# EAGLE design cheenrimen (EAGLE 7.6.0)
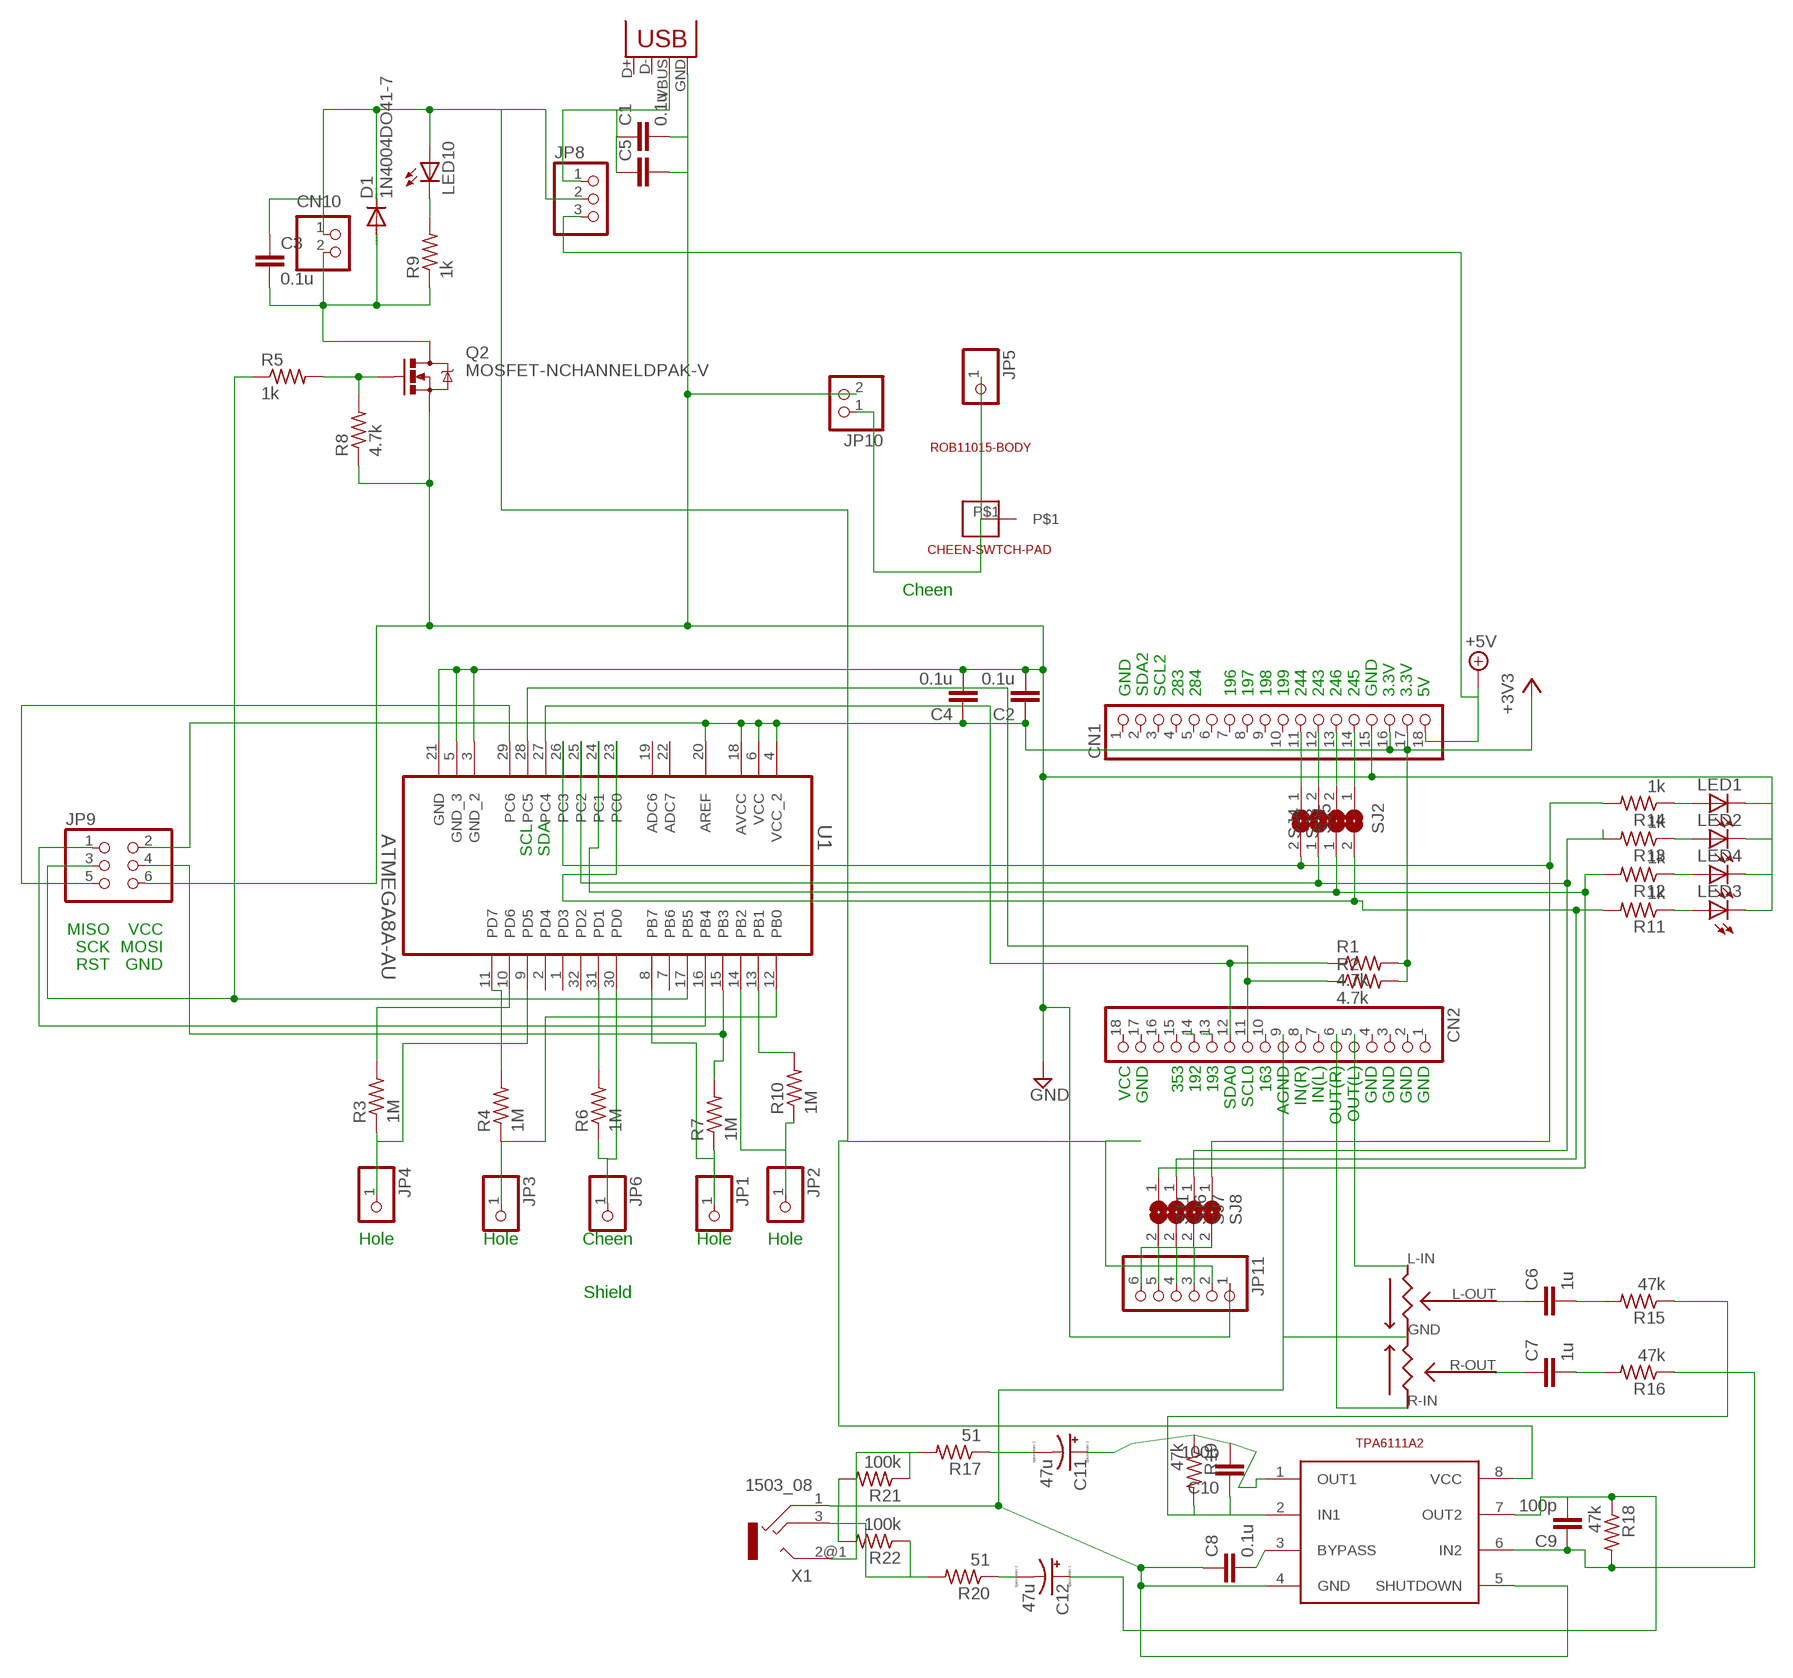
[diagram p0: schematic, sheet 1]

## Parts
C1  0.1u  C-EUC0603K  [C0603K]
C2  0.1u  C-EUC0603K  [C0603K]
C3  0.1u  C-EUC0603K  [C0603K]
C4  0.1u  C-EUC0603K  [C0603K]
C5  C-EUC0805  [C0805]
C6  1u  C-EUC0603K  [C0603K]
C7  1u  C-EUC0603K  [C0603K]
C8  0.1u  C-EUC0603K  [C0603K]
C9  100p  C-EUC0603K  [C0603K]
C10  100p  C-EUC0603K  [C0603K]
C11  47u  CPOL-US153CLV-0605  [153CLV-0605]
C12  47u  CPOL-US153CLV-0605  [153CLV-0605]
CN1  PINHD-1X18  [1X18]
CN2  PINHD-1X18  [1X18]
CN10  B2B-PH-K-S  [B2B-PH-K-S]
D1  1N4004DO41-7  [DO41-7.6]
JP1  PINHD-1X15MM  [1X01-LARGE]
JP2  PINHD-1X15MM  [1X01-LARGE]
JP3  PINHD-1X15MM  [1X01-LARGE]
JP4  PINHD-1X15MM  [1X01-LARGE]
JP5  PINHD-1X1NORMAL  [1X01-S]
JP6  PINHD-1X1NORMAL  [1X01-S]
JP7  USB-MICROB  [USB-MICROB]
JP8  PINHD-1X3  [1X03]
JP9  PINHD-2X3  [2X03]
JP10  PINHD-1X2  [1X02]
JP11  PINHD-1X6  [1X06]
LED1  LEDSML0805  [SML0805]
LED2  LEDSML0805  [SML0805]
LED3  LEDSML0805  [SML0805]
LED4  LEDSML0805  [SML0805]
LED10  LED3MM  [LED3MM]
Q2  MOSFET-NCHANNELDPAK-V  [DPAK-V]
R1  4.7k  R-US_R0603  [R0603]
R2  4.7k  R-US_R0603  [R0603]
R3  1M  R-US_R0805  [R0805]
R4  1M  R-US_R0805  [R0805]
R5  1k  R-US_R0603  [R0603]
R6  1M  R-US_R0805  [R0805]
R7  1M  R-US_R0805  [R0805]
R8  4.7k  R-US_R0603  [R0603]
R9  1k  R-US_R0603  [R0603]
R10  1M  R-US_R0805  [R0805]
R11  1k  R-US_R0603  [R0603]
R12  1k  R-US_R0603  [R0603]
R13  1k  R-US_R0603  [R0603]
R14  1k  R-US_R0603  [R0603]
R15  47k  R-US_R0603  [R0603]
R16  47k  R-US_R0603  [R0603]
R17  51  R-US_R0603  [R0603]
R18  47k  R-US_R0603  [R0603]
R19  47k  R-US_R0603  [R0603]
R20  51  R-US_R0603  [R0603]
R21  100k  R-US_R0603  [R0603]
R22  100k  R-US_R0603  [R0603]
SJ1  SJ  [SJ]
SJ2  SJ  [SJ]
SJ3  SJ  [SJ]
SJ4  SJ  [SJ]
SJ5  SJ  [SJ]
SJ6  SJ  [SJ]
SJ7  SJ  [SJ]
SJ8  SJ  [SJ]
U1  ATMEGA8A-AU  [QFP80P900X900X120-32N]
U$2  CHEEN-SWITCH-PAD  [CHEEN-SWITCH-PAD]
U$3  ROB11015-BODY  [SOLENOID-ROB11015-BODY]
U$4  5PIN-RADIO-POT  [5PIN-RADIO-POT]
U$5  TPA6111A2  [MSOP8]
X1  1503_08  [1503_08]

## Nets
+3V3: C2.1 C4.1 CN1.16 CN1.17 JP9.2 R1.2 R2.2 U1.4(VCC_2) U1.6(VCC) U1.18(AVCC) U1.20(AREF)
+5V: CN1.18 JP8.3
+5V/1: C3.1 CN10.1 D1.C JP8.2 JP11.2 LED10.A U$5.8(VCC)
AGND: C8.1 CN2.9 R21.2 R22.2 U$4.GND U$5.4(GND) U$5.5(SHUTDOWN) X1.1(GND)
GND [GND]: C1.2 C2.2 C4.2 C5.2 CN1.15 JP7.GND JP9.6 JP10.2 JP11.1 LED1.C LED2.C LED3.C LED4.C Q2.P$3(S) R8.1 U1.3(GND_2) U1.5(GND_3) U1.21(GND)
N$1: C1.1 C5.1 JP7.VBUS JP8.1
N$2: JP9.1 U1.16(PB4)
N$3: CN1.14 SJ2.1
N$4: CN1.13 SJ3.2
N$5: CN1.12 SJ4.2
N$6: JP5.1 JP10.1 U$2.P$1
N$7: CN2.11 R2.1 U1.28(PC5)
N$8: JP9.3 R5.1 U1.17(PB5)
N$9: CN2.12 R1.1 U1.27(PC4)
N$10: R3.2 U1.10(PD6)
N$11: JP4.1 R3.1 U1.9(PD5)
N$12: CN1.11 SJ5.1
N$13: Q2.P$1(G) R5.2 R8.2
N$14: C3.2 CN10.2 D1.A Q2.P$2(D) R9.1
N$15: R6.2 U1.31(PD1)
N$16: LED10.K(C) R9.2
N$17: JP2.1 R10.1 U1.14(PB2)
N$18: R4.2 U1.11(PD7)
N$19: JP3.1 R4.1 U1.12(PB0)
N$20: R10.2 U1.13(PB1)
N$21: JP6.1 R6.1 U1.30(PD0)
N$22: JP9.4 R7.2 U1.15(PB3)
N$23: JP1.1 R7.1 U1.8(PB7)
N$24: JP9.5 U1.29(PC6)
N$25: R14.2 SJ5.2 SJ8.1 U1.26(PC3)
N$26: R13.2 SJ4.1 SJ7.1 U1.25(PC2)
N$27: R12.2 SJ1.1 SJ3.1 U1.24(PC1)
N$28: R11.2 SJ2.2 SJ6.1 U1.23(PC0)
N$29: LED1.A R14.1
N$30: LED2.A R13.1
N$31: LED4.A R12.1
N$32: LED3.A R11.1
N$33: JP11.6 SJ1.2
N$34: CN2.14
N$35: CN2.13
N$36: JP11.5 SJ6.2
N$37: JP11.4 SJ7.2
N$38: JP11.3 SJ8.2
N$39: R17.2 R21.1 X1.2@1(L)
N$40: CN2.5 U$4.L-IN(IN-L)
N$41: CN2.6 U$4.R-IN(IN-R)
N$42: C6.1 U$4.L-OUT(OUT-L)
N$43: C7.1 U$4.R-OUT(OUT-R)
N$44: C6.2 R15.2
N$45: C7.2 R16.2
N$46: C10.1 R15.1 R19.2 U$5.2(IN1)
N$47: C9.1 R16.1 R18.2 U$5.6(IN2)
N$48: C11.- R17.1
N$49: C8.2 U$5.3(BYPASS)
N$50: C9.2 C12.+ R18.1 U$5.7(OUT2)
N$51: C10.2 C11.+ R19.1 U$5.1(OUT1)
N$53: R20.2 R22.1 X1.3(R)
N$54: C12.- R20.1
Unconnected: CN1.1 CN1.2 CN1.3 CN1.4 CN1.5 CN1.6 CN1.7 CN1.8 CN1.9 CN1.10 CN2.1 CN2.2 CN2.3 CN2.4 CN2.7 CN2.8 CN2.10 CN2.15 CN2.16 CN2.17 CN2.18 JP7.D+ JP7.D- U1.1(PD3) U1.2(PD4) U1.7(PB6) U1.19(ADC6) U1.22(ADC7) U1.32(PD2) X1.2@2

## Notes on the sheet
- Cheen
- GND
  SDA2
  SCL2
  283
  284
  
  196
  197
  198
  199
  244
  243
  246
  245
  GND
  3.3V
  3.3V
  5V
- SCL | SDA
- MISO
  SCK
  RST
- VCC
  MOSI
  GND
- VCC
  GND
  
  353
  192
  193
  SDA0
  SCL0
  163
  AGND
  IN(R)
  IN(L)
  OUT(R)
  OUT(L)
  GND
  GND
  GND
  GND
- Hole | Hole | Cheen | Hole | Hole
- Shield

## Library data of the parts
C1-C4 C6-C10 = resistor:C-EU: CAPACITOR, European symbol
C5 = 0my:C-EU: CAPACITOR, European symbol
C11 C12 = 0my:CPOL-US: POLARIZED CAPACITOR, American symbol
CN1 CN2 = pinhead:PINHD-1X18: PIN HEADER
CN10 = 0-cheen:B2B-PH-*: Wire-to-Board 2.0mm pitch top mount connector Source: http://www.jst-mfg.com/product/pdf/jpn/PH.pdf http://www.jst-mfg.com/product/detail.php?series=199
D1 = 0my:1N4004: DIODE general purpose rectifier, 1 A
JP1-JP4 = 0my:PINHD-1X1: PIN HEADER
JP5 JP6 = 0-cheen:PINHD-1X1: PIN HEADER
JP7 = 0-cheen:USB: USB Connectors USB-B-PTH is fully proven SKU : PRT-00139/CONN-08278 USB-miniB is fully proven SKU : PRT-00587 USB-A-PCB is untested. USB-A-H is throughly reviewed, but untested. Spark Fun Electronics SKU : PRT-00437 USB-B-SMT is throughly reviewed, but untested. Needs silkscreen touching up. USB-A-S has not been used/tested USB-MB-H has not been used/tested USB-MICROB has been used. CONN-09505; PROD_ID: CONN-09505
JP8 = 0-cheen:PINHD-1X3: PIN HEADER
JP9 = 0my:PINHD-2X3: PIN HEADER
JP10 = 0my:PINHD-1X2: PIN HEADER
JP11 = pinhead:PINHD-1X6: PIN HEADER
LED1-LED4 LED10 = led:LED: LED OSRAM: - CHIPLED LG R971, LG N971, LY N971, LG Q971, LY Q971, LO R971, LY R971 LH N974, LH R974 LS Q976, LO Q976, LY Q976 LO Q996 - Hyper CHIPLED LW Q18S LB Q993, LB Q99A, LB R99A - SideLED LS A670, LO A670, LY A670, LG A670, LP A670 LB A673, LV A673, LT A673, LW A673 LH A674 LY A675 LS A676, LA A676, LO A676, LY A676, LW A676 LS A679, LY A679, LG A679 - Hyper Micro SIDELED® LS Y876, LA Y876, LO Y876, LY Y876 LT Y87S - SmartLED LW L88C, LW L88S LB L89C, LB L89S, LG L890 LS L89K, LO L89K, LY L89K LS L896, LA L896, LO L896, LY L896 - TOPLED LS T670, LO T670, LY T670, LG T670, LP T670 LSG T670, LSP T670, LSY T670, LOP T670, LYG T670 LG T671, LOG T671, LSG T671 LB T673, LV T673, LT T673, LW T673 LH T674 LS T676, LA T676, LO T676, LY T676, LB T676, LH T676, LSB T676, LW T676 LB T67C, LV T67C, LT T67C, LS T67K, LO T67K, LY T67K, LW E67C LS E67B, LA E67B, LO E67B, LY E67B, LB E67C, LV E67C, LT E67C LW T67C LS T679, LY T679, LG T679 LS T770, LO T770, LY T770, LG T770, LP T770 LB T773, LV T773, LT T773, LW T773 LH T774 LS E675, LA E675, LY E675, LS T675 LS T776, LA T776, LO T776, LY T776, LB T776 LHGB T686 LT T68C, LB T68C - Hyper Mini TOPLED® LB M676 - Mini TOPLED Santana® LG M470 LS M47K, LO M47K, LY M47K Source: http://www.osram.convergy.de LUXEON: - LUMILED® LXK2-PW12-R00, LXK2-PW12-S00, LXK2-PW14-U00, LXK2-PW14-V00 LXK2-PM12-R00, LXK2-PM12-S00, LXK2-PM14-U00 LXK2-PE12-Q00, LXK2-PE12-R00, LXK2-PE12-S00, LXK2-PE14-T00, LXK2-PE14-U00 LXK2-PB12-K00, LXK2-PB12-L00, LXK2-PB12-M00, LXK2-PB14-N00, LXK2-PB14-P00, LXK2-PB14-Q00 LXK2-PR12-L00, LXK2-PR12-M00, LXK2-PR14-Q00, LXK2-PR14-R00 LXK2-PD12-Q00, LXK2-PD12-R00, LXK2-PD12-S00 LXK2-PH12-R00, LXK2-PH12-S00 LXK2-PL12-P00, LXK2-PL12-Q00, LXK2-PL12-R00 Source: www.luxeon.com KINGBRIGHT: KA-3528ASYC Source: www.kingbright.com
Q2 = 0my:MOSFET-NCHANNEL: Generic NMOS footprint
R1-R22 = 0my:R-US_: RESISTOR, American symbol
SJ1-SJ8 = jumper:SJ: SMD solder JUMPER
U1 = Atmel_By_element14_Batch_1-00:ATMEGA8A-AU: Programmable Flash; MPN: ATMEGA8A-AU; OC_FARNELL: 1748532; OC_NEWARK: 26R5638; PACKAGE: TQFP-32; SUPPLIER: Atmel
U$2 = 0-cheen:CHEEN-SWITCH-PAD
U$3 = 0-cheen:ROB11015-BODY
U$4 = 0-cheen:5PIN-RADIO-POT
U$5 = 0-cheen:TPA6111A2
X1 = 0my:1503_?: Jack connectors according to JISC 6560, 3.5 mm Klinkensteckverbinder nach JISC 6560, 3,5 mm Source: http://www.lumberg.com/Produkte/PDFs/1503_08.pdf; OC_FARNELL: unknown; OC_NEWARK: unknown

## Net classes
0 default: width 0.406 mm, drill 0.305 mm, clearance 0.305 mm
2 GND: width 0.813 mm, drill 0.61 mm, clearance 0.406 mm

## Board
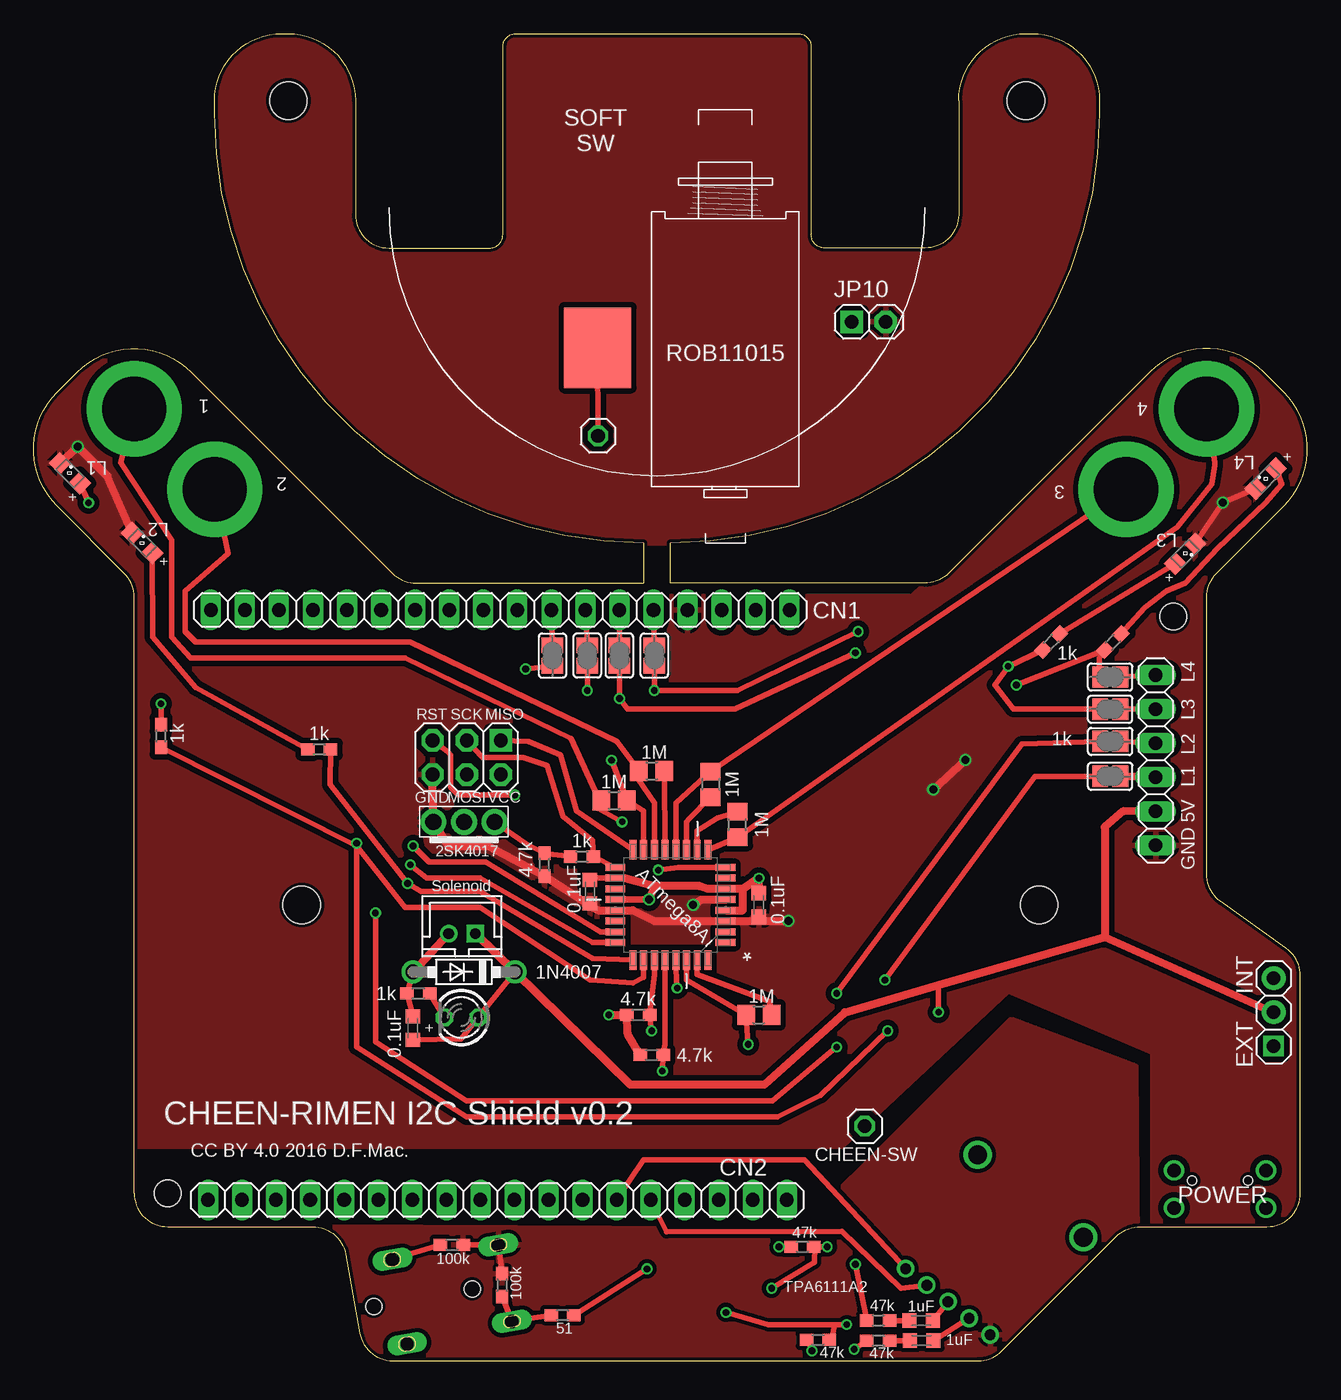
[diagram p1: board, top side]
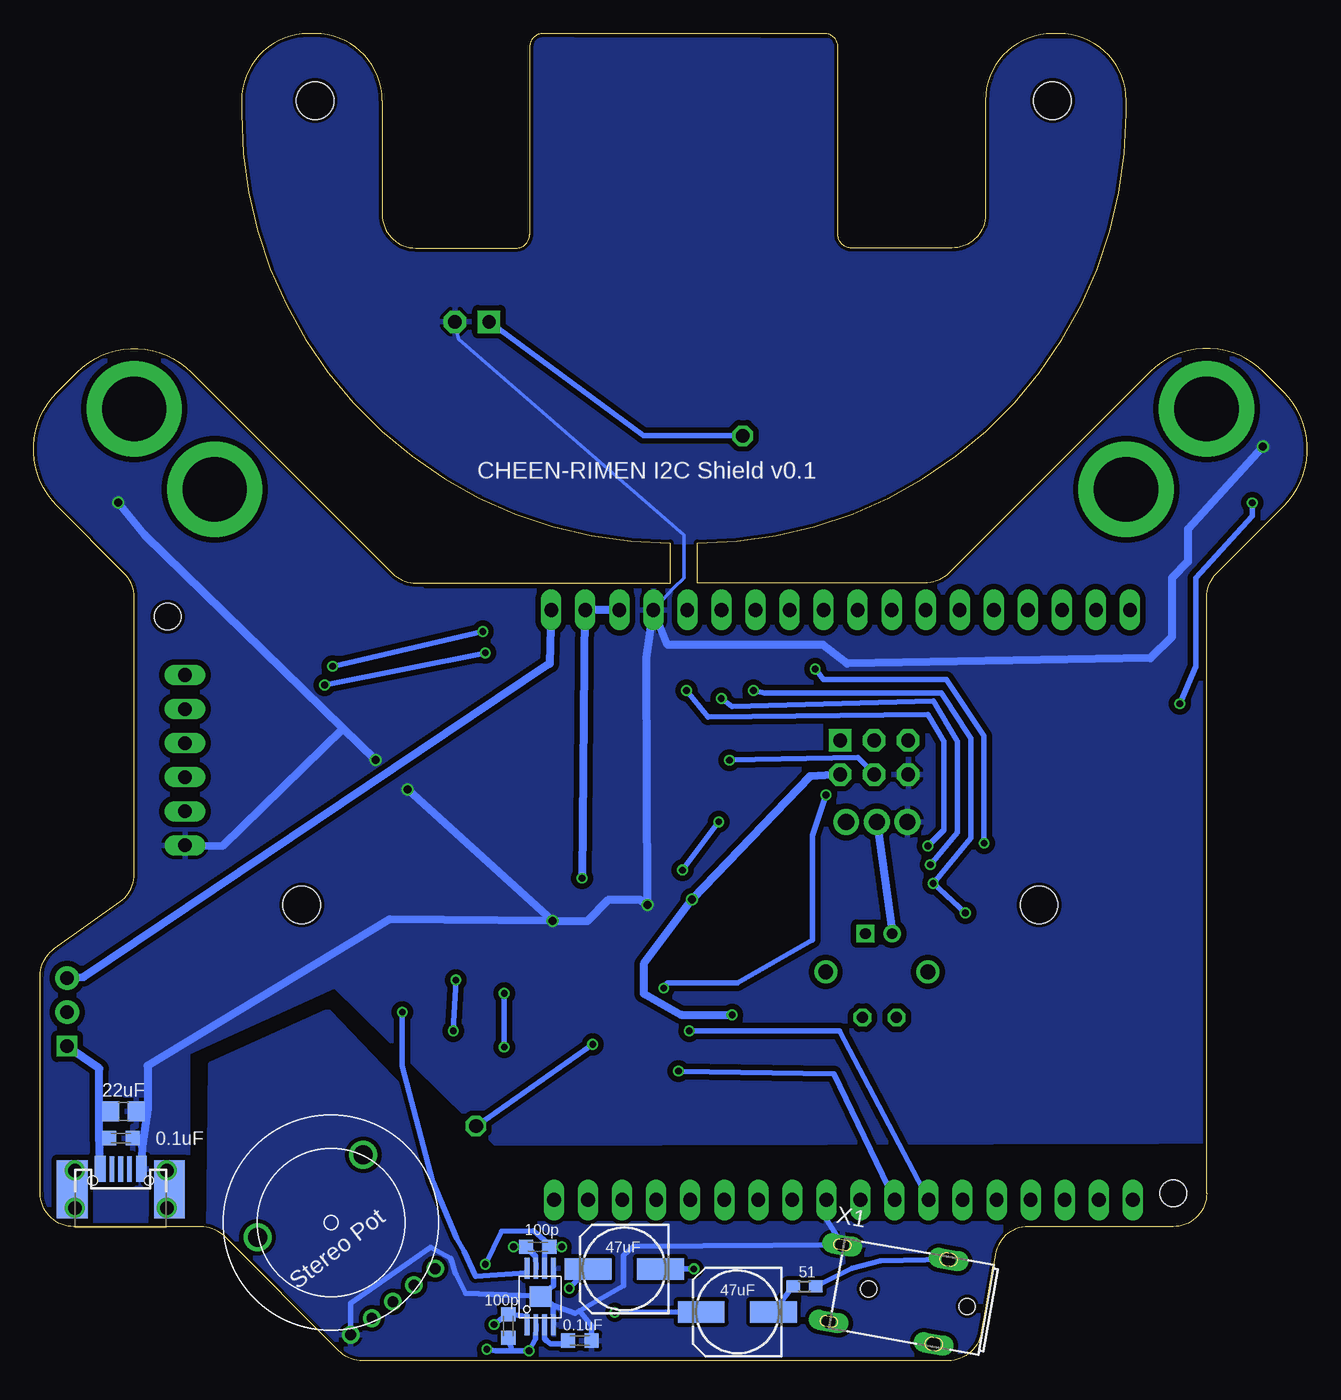
[diagram p2: board, bottom side, seen from below]

Size 95.02 x 99 mm. Coordinates in mm from the lower left corner, seen from the top.
Outline: 7.51,12.5 7.51,56.96 arc45 6.78,58.73 1.75,63.76 arc-90 1.75,72.24 3.27,73.76 arc-90 11.75,73.76 26.78,58.73 arc45 28.54,58 45.51,58 45.51,61 arc-90 13.51,93 13.51,94 arc-90 18.51,99 19.01,99 arc-90 24.01,94 24.01,85.5 arc90 26.51,83 34.01,83 arc90 35.01,84 35.01,98 arc-90 36.01,99 57.01,99 arc-90 58.01,98 58.01,84 arc90 59.01,83 66.51,83 arc90 69.01,85.5 69.01,94 arc-90 74.01,99 74.51,99 arc-90 79.51,94 79.51,93 arc-90 47.51,61 47.51,58 66.47,58 arc45 68.24,58.73 83.27,73.76 arc-90 91.75,73.76 93.27,72.24 arc-90 93.27,63.76 88.24,58.73 arc45 87.51,56.96 87.51,36.29 arc54 88.56,34.25 93.46,30.75 arc-54 94.51,28.71 94.51,12.5 arc-90 92.01,10 82.54,10 arc45 80.78,9.27 72.24,0.73 arc-45 70.47,0 26.8,0 arc-80 24.34,2.06 23.28,7.94 arc80 20.82,10 10.01,10 arc-90 7.51,12.5
Copper layers (1*16): Top 0.035mm / dielectric 1.5mm / Bottom 0.035mm
Design rules "Elecrow_2-layer_eagle_rule": minimum track width 6mil, minimum drill 12mil, track to track 6mil, track to pad 6mil, pad to pad 6mil, via to via 6mil, smd to smd 0mil, copper to edge 10mil, drill to drill 10mil, minimum pad ring 10mil, minimum via ring 6mil, stop-mask expansion 2mil, vias tented up to drill 100mil, thermal gap 10mil
Holes 2.8 mm at 20.01,34 75.01,34 19.01,94 74.01,94
Holes 2 mm at 10.01,12.5 85.01,55.5

### Footprints (pad centres in the part's own frame; a part is rotated, then mirrored left to right if it is on the bottom)
C0603K = smd 1.05 x 1.08: 1 -0.875,0; 2 0.875,0
C0805 = smd 1.3 x 1.5: 1 -0.95,0; 2 0.95,0
153CLV-0605 = smd 3.5 x 1.6: + 2.7,0; - -2.7,0
1X18 = drill 1.016 long: 1 -21.59,0; 2 -19.05,0; 3 -16.51,0; 4 -13.97,0; 5 -11.43,0; 6 -8.89,0; 7 -6.35,0; 8 -3.81,0; 9 -1.27,0; 10 1.27,0; 11 3.81,0; 12 6.35,0; 13 8.89,0; 14 11.43,0; 15 13.97,0; 16 16.51,0; 17 19.05,0; 18 21.59,0
B2B-PH-K-S = drill 0.8 square: 1 -1,0 | drill 0.8: 2 1,0
DO41-7.6 = drill 1.1 pad 1.7: A 3.81,0; C -3.81,0
1X01-LARGE = drill 4.8 pad 7.112: 1 0,0
1X01-S = drill 1.016 octagon: 1 0,0
USB-MICROB = smd 0.35 x 1.9: D+ 0,2.904; D- -0.65,2.904; ID 0.65,2.904 | smd 0.813 x 1.93: GND 1.541,2.929; VBUS -1.541,2.929 | smd 2.286 x 4.318: MT1 3.62,1.397; MT3 -3.619,1.397 | drill 1: P$2 -3.429,2.794; P$4 -3.429,0; P$5 3.429,2.794; P$6 3.429,0 | hole 0.7: -2.095,2.032; 2.095,2.032
1X03 = drill 1.016 square: 1 -2.54,0 | drill 1.016 pad 1.778: 2 0,0; 3 2.54,0
2X03 = drill 1.016 pad 1.676 square: 1 -2.54,-1.27 | drill 1.016 pad 1.676 octagon: 2 -2.54,1.27; 3 0,-1.27; 4 0,1.27; 5 2.54,-1.27; 6 2.54,1.27
1X02 = drill 1 pad 1.676 square: 1 -1.27,0 | drill 1 pad 1.676 octagon: 2 1.27,0
1X06 = drill 1.016 long: 1 -6.35,0; 2 -3.81,0; 3 -1.27,0; 4 1.27,0; 5 3.81,0; 6 6.35,0
SML0805 = smd 1.2 x 1.2: A 1.05,0; C -1.05,0
LED3MM = drill 0.813 octagon: A -1.27,0; K 1.27,0
DPAK-V = drill 1.2 pad 1.93: P$1 -2.286,0; P$2 0,0; P$3 2.286,0
R0603 = smd 1 x 0.9: 1 -0.85,0; 2 0.85,0
R0805 = smd 1.3 x 1.5: 1 -0.95,0; 2 0.95,0
SJ = smd 1.168 x 1.6: 1 -0.762,0; 2 0.762,0
QFP80P900X900X120-32N = smd 1.473 x 0.508: 1 -4.115,2.794; 2 -4.115,2.007; 3 -4.115,1.194; 4 -4.115,0.406; 5 -4.115,-0.406; 6 -4.115,-1.194; 7 -4.115,-2.007; 8 -4.115,-2.794; 17 4.115,-2.794; 18 4.115,-2.007; 19 4.115,-1.194; 20 4.115,-0.406; 21 4.115,0.406; 22 4.115,1.194; 23 4.115,2.007; 24 4.115,2.794 | smd 0.508 x 1.473: 9 -2.794,-4.115; 10 -2.007,-4.115; 11 -1.194,-4.115; 12 -0.406,-4.115; 13 0.406,-4.115; 14 1.194,-4.115; 15 2.007,-4.115; 16 2.794,-4.115; 25 2.794,4.115; 26 2.007,4.115; 27 1.194,4.115; 28 0.406,4.115; 29 -0.406,4.115; 30 -1.194,4.115; 31 -2.007,4.115; 32 -2.794,4.115
CHEEN-SWITCH-PAD = smd 5 x 6: P$1 0,0
5PIN-RADIO-POT = drill 0.8: GND -4,0; L-IN 2,0; L-OUT -2,0; R-IN 4,0; R-OUT 0,0 | drill 1.4: HOLE-1 -5,10; HOLE-2 5,10
MSOP8 = smd 1.575 x 0.356: 1 -2.105,1.037; 2 -2.105,0.387; 3 -2.105,-0.263; 4 -2.105,-0.913; 5 2.083,-0.913; 6 2.083,-0.263; 7 2.083,0.387; 8 2.083,1.037 | smd 1.5 x 1.65: PAD -0.013,0.051
1503_08 = drill 1 pad 1.2 long: 1 -2.9,-8; 2@1 -3.2,0; 2@2 3.2,0; 3 2.9,-8 | hole 1.2: 0,1.96; 0,-5.5

### Placement (x,y rotation side)
C1  88.51,16.6 0 bottom
C2  54.11,34 270 top
C3  28.31,24.8 90 top
C4  41.51,35 270 top
C5  88.31,18.6 0 bottom
C6  66.26,1.5 180 top
C7  66.21,3 180 top
C8  54.26,1.5 180 bottom
C9  57.41,8.5 180 bottom
C10  59.61,2.6 90 bottom
C11  42.51,3.65 180 bottom
C12  50.96,6.85 180 bottom
CN1  34.81,56 0 top
CN2  34.6,12 180 top
CN10  31.96,31.86 180 top
D1  32.11,29 180 top
JP1  7.51,71 0 top
JP2  13.51,65 0 top
JP3  81.51,65 0 top
JP4  87.51,71 0 top
JP5  42.11,69 0 top
JP6  62.01,17.5 0 top
JP7  88.51,11.4 0 bottom
JP8  92.51,26 90 top
JP9  32.31,45 180 top
JP10  62.31,77.5 0 top
JP11  83.71,44.8 90 top
LED1  2.71,66.2 315 top
LED2  8.11,61 315 top
LED3  85.91,60.2 225 top
LED4  91.91,65.8 45 top
LED10  31.91,25.6 180 top
Q2  32.11,40.2 180 top
R1  45.11,25.8 180 top
R2  46.11,22.8 180 top
R3  52.51,40 90 top
R4  50.51,43 270 top
R5  40.91,37.6 180 top
R6  54.11,25.8 0 top
R7  43.31,41.8 0 top
R8  38.11,37 90 top
R9  28.71,27.4 0 top
R10  46.11,44 0 top
R11  75.91,53.6 225 top
R12  80.51,53.6 225 top
R13  21.31,45.6 0 top
R14  9.51,46.6 270 top
R15  63.01,1.5 0 top
R16  63.01,3 0 top
R17  37.51,5.55 0 bottom
R18  57.36,8.5 180 top
R19  58.51,1.55 180 top
R20  39.46,3.4 180 top
R21  31.21,8.65 0 top
R22  34.96,5.65 90 top
SJ1  80.31,51 0 top
SJ2  46.31,52.6 270 top
SJ3  43.71,52.6 90 top
SJ4  41.31,52.6 90 top
SJ5  38.71,52.6 270 top
SJ6  80.31,48.6 0 top
SJ7  80.31,46.2 0 top
SJ8  80.31,43.6 0 top
U1  47.51,34 180 top
U$2  42.08,75.56 0 top
U$3  51.61,76.2 0 top
U$4  68.21,4.4 38 bottom
U$5  57.16,4.8 90 bottom
X1  27.31,4.4 260 bottom

### Tracks (layer width: path | path; a pad name or v marks a point on that pad's centre or on a via)
+3V3  (via drill 0.5, 0.6)
  Top 0.406: C4.1 41.51,36 U1.18
  Top 0.5: U1.18 44.11,36 | U1.20 v45.91,34.4
  Top 0.61: R2.2 44.31,24.4 R1.2 v42.91,25.8 | 46.31,35.43 49.71,35.4 50.31,35.2 U1.6 52.91,35.2 | 46.31,35.43 v45.91,34.4 | 44.11,36 46.31,35.43 | 52.91,35.2 v54.11,36 C2.1 | U1.4 52.91,33.6 52.91,35.2
  Bottom 0.406: CN1.16 CN1.17
  Bottom 0.61: CN1.16 53.91,56 v54.11,36 | v42.91,25.8 46.71,25.8 49.51,27.4 49.51,29.6 v45.91,34.4 37.11,43.6 JP9.2
+5V
  Bottom 0.61: CN1.18 56.51,52 91.31,28.6 JP8.3
+5V/1  (via drill 0.5)
  Top 0.406: D1.C LED10.A 31.91,24 C3.1 | v67.51,26 67.5,28.02
  Top 0.61: CN10.1 D1.C 44.51,20.6 54.51,20.6 60.51,26 67.5,28.02 79.91,31.6 | 79.91,31.6 JP8.2 | JP11.2 81.31,41 79.91,39.8 79.91,31.6
  Bottom 0.406: U$5.8 58.21,6.55 62.06,6.3 62.91,8.15 63.46,9.15 65.26,13.4 67.51,22 v67.51,26
AGND
  Top 0.406: R21.2 X1.1 R22.2
  Bottom 0.406: U$4.GND 71.36,4.3 65.41,8.45 63.91,7.65 63.81,7.35 63.56,6.55 63.51,6.45 62.78,5.05 | 62.78,5.05 57.61,4.85 57.41,4.95 57.21,4.95 | 57.21,4.95 56.26,4.15 | 56.26,4.15 U$5.4 | 57.11,4.8 62.78,5.05 | 56.26,4.15 54.61,3.55 54.28,3.73 | 54.28,3.73 51.01,5.6 51.01,7.85 50.26,8.55 X1.1 35.86,10.55 CN2.9 | C8.1 53.41,2.6 54.28,3.73 | U$5.5 56.21,6.88 56.21,5.6 57.21,4.95
  pour Bottom: 34.56,10.25 58.26,10.2 61.91,14.6 62.01,14.5 73.06,26.05 81.81,22.1 82.06,0.15 22.91,0 22.91,10.2 34.51,10.2
  pour Top: 22.01,10 22.11,-0.4 82.41,-0.4 82.21,21.95 72.96,25.45 57.21,9.8
GND  (via drill 0.6)
  Top 0.406: LED3.C v88.71,64 LED4.C | C4.2 41.88,33.75
  Top 0.61: JP9.6 Q2.P$3 30.91,38.4 33.91,38.4 R8.1 41.88,33.75 42.11,33.6 U1.21 44.71,33.6 46.31,32.8 U1.3 v56.31,32.8 54.31,32.8 C2.2 | v49.21,34 49.81,34.4 U1.5 | LED1.C v3.31,68.2 5.51,66 LED2.C | v67.11,42.6 v69.51,44.8
  Bottom 0.254: CN1.15 47.31,57.6 46.51,58.4 46.51,61.6 63.31,76.2 63.51,77 JP10.2
  Bottom 0.406: C1.2 86.92,16.01 | C5.2 86.55,18.52
  Bottom 0.61: v56.31,32.8 68.45,32.93 86.51,22 86.51,18.8 86.55,18.52 86.92,16.01 JP7.GND | v56.31,32.8 53.71,32.8 52.11,34.4 49.81,34.4 v49.21,34 49.31,52.4 CN1.15 47.71,53.4 36.11,53.4 34.31,52 11.71,52.4 10.11,54 10.11,58.4 8.91,59.6 8.91,62.05 v3.31,68.2 | v56.31,32.8 v67.11,42.6 | v69.51,44.8 71.94,47.18 | 71.94,47.18 86.71,61.6 v88.71,64 | JP11.1 80.91,38.4 71.94,47.18
  pour Top: -0.99,16 -0.99,99 81.51,99 81.51,83 72.51,70 59.51,61 34.51,61 20.51,71 20.71,65.6 27.91,58.4 30.51,57 65.51,57 87.51,78 96.51,68 96.51,10 83.51,10 83.51,23 72.71,27.6 60.31,16
  pour Bottom: -0.89,98.4 82.51,98.6 82.51,79.8 70.11,66.4 53.11,61 34.91,61.2 43.31,57.4 65.91,57.4 87.71,78 97.71,67.4 97.11,9.6 83.51,9.6 83.51,23 72.51,28 60.51,16.2 -1.29,16.4
N$1
  Bottom 0.406: C1.1 90.11,17 | C5.1 90.11,18.4
  Bottom 0.61: JP7.VBUS 90.11,17 90.11,18.4 90.11,21.8 JP8.1
N$2
  Top 0.406: U1.16 40.51,41 39.31,45.2 36.91,46.2 JP9.1
N$3
  Top 0.406: CN1.14 SJ2.1
N$4
  Top 0.406: CN1.13 SJ3.2
N$5
  Top 0.406: CN1.12 SJ4.2
N$6
  Top 0.406: U$2.P$1 JP5.1
  Bottom 0.406: JP10.1 49.51,69 JP5.1
N$7  (via drill 0.5)
  Top 0.406: U1.28 47.11,28.6 47.11,23.6 R2.1 v46.91,21.6
  Bottom 0.406: v46.91,21.6 35.31,21.4 CN2.11
N$8
  Top 0.406: U1.17 R5.1 41.71,38.8 39.51,40.6 38.31,44.4 36.51,45 33.51,45 JP9.3
N$9  (via drill 0.5)
  Top 0.406: v46.11,24.6 R1.1 46.31,28.8 46.31,29 U1.27
  Bottom 0.406: CN2.12 34.91,24.6 v46.11,24.6
N$10
  Top 0.406: U1.10 49.51,39.5 51.01,40.5 R3.2
N$11
  Top 0.406: U1.9 R3.1 85.31,62.2 87.91,65.4 88.11,66.8 88.11,67 JP4.1
N$12
  Top 0.406: CN1.11 SJ5.1
N$13
  Top 0.406: R5.2 R8.2 36.71,38.6 Q2.P$1
N$14
  Top 0.406: D1.A R9.1 C3.2
  Top 0.61: CN10.2 D1.A
  Bottom 0.61: Q2.P$2 CN10.2
N$15
  Top 0.406: R6.2 54.91,26.8 49.51,28.8 U1.31
N$16
  Top 0.406: R9.2 LED10.K
N$17
  Top 0.406: U1.14 46.31,41.6 45.11,43.4 R10.1 43.51,46.2 28.11,53.6 12.11,53.6 11.31,54.4 11.31,57.4 14.51,60.2 JP2.1
N$18
  Top 0.406: R4.2 48.91,40.4 48.71,40.2 U1.11
N$19
  Top 0.406: JP3.1 R4.1 47.91,41.6 47.91,40.4 U1.12
N$20
  Top 0.406: R10.2 U1.13
N$21  (via drill 0.5)
  Top 0.406: U1.30 48.71,28.4 R6.1 v53.31,23.6
  Bottom 0.406: v53.31,23.6 JP6.1
N$22  (via drill 0.5)
  Top 0.406: U1.15 45.51,41 R7.2 v43.11,44.8
  Bottom 0.406: v43.11,44.8 33.51,45 JP9.4
N$23  (via drill 0.5)
  Top 0.406: R7.1 42.11,41.2 | v43.91,40.2 42.11,41.2 | 42.11,41.2 42.11,42 40.11,46.4 27.71,52.4 11.71,52.4 10.31,54 10.31,61.2 6.51,67 JP1.1 | v46.61,36.6 48.11,36.8 U1.8
  Bottom 0.406: v43.91,40.2 v46.61,36.6
N$24  (via drill 0.5)
  Top 0.406: JP9.5 30.91,45.4 31.11,45.2 31.11,42.8 31.71,42.2 v35.91,42.2 | v48.01,27.8 47.91,29.2 U1.29
  Bottom 0.406: v35.91,42.2 36.91,39.2 36.91,31.4 42.51,28.2 47.71,28.2 v48.01,27.8
N$25  (via drill 0.5)
  Top 0.406: U1.26 45.51,28.6 44.71,28.2 41.51,28.4 33.31,33.8 27.71,33.8 24.11,38.4 | 24.11,38.4 v24.11,38.6 24.11,23.4 32.31,18.2 55.51,18.2 58.71,19.8 v63.71,24.6 | v36.71,51.6 SJ5.2 | 24.11,38.4 R14.2 | v63.51,28.4 74.71,43.6 SJ8.1
  Bottom 0.406: v24.11,38.6 24.11,46.6 26.91,50.8 36.11,50.8 v36.71,51.6 | v63.71,24.6 v63.51,28.4
N$26  (via drill 0.5)
  Top 0.406: SJ4.1 v41.31,50 | U1.25 41.71,30 33.31,35 28.91,35 v27.91,35.6 22.11,43 R13.2 | v25.51,33.4 25.51,23.8 32.31,19.4 55.11,19.4 v59.91,23.4 | SJ7.1 73.71,46 v59.91,27.4
  Bottom 0.406: v41.31,50 40.51,49.8 27.31,49.8 25.11,46.4 25.11,39 v27.91,35.6 v25.51,33.4 | v59.91,27.4 v59.91,23.4
N$27  (via drill 0.5)
  Top 0.406: SJ3.1 v43.71,49.4 44.31,48.6 52.31,48.6 v61.31,52.8 | v28.11,37 29.31,36 33.31,36 41.71,31.2 U1.24 | v73.31,50.4 R12.2 79.51,52.4 SJ1.1
  Bottom 0.406: v43.71,49.4 42.91,48.8 27.91,49.2 26.11,46.2 26.11,39.4 v28.11,37 | v73.31,50.4 v61.31,52.8
N$28  (via drill 0.5)
  Top 0.406: SJ2.2 v46.31,50 52.51,50 v61.51,54.4 | v28.31,38.4 29.51,37.2 33.71,37.2 42.31,32 U1.23 | R11.2 v72.71,51.8 71.71,50.4 73.11,48.6 SJ6.1
  Bottom 0.406: v46.31,50 44.71,48 28.31,48.2 27.11,46.2 27.11,39.6 v28.31,38.4 | v72.71,51.8 v61.51,54.4
N$29  (via drill 0.5)
  Top 0.406: R14.1 v9.51,49 | v4.11,64 LED1.A
  Bottom 0.406: v9.51,49 8.31,51.8 8.31,58.4 4.11,63 v4.11,64
N$30
  Top 0.406: LED2.A 8.91,54 12.11,50.2 R13.1
N$31
  Top 0.406: LED4.A 93.11,65.4 91.91,64 88.31,60.6 85.91,58 84.51,57.4 82.91,56.2 R12.1
N$32
  Top 0.406: R11.1 LED3.A
N$33
  Top 0.406: SJ1.2 JP11.6
N$36
  Top 0.406: SJ6.2 JP11.5
N$37
  Top 0.406: SJ7.2 JP11.4
N$38
  Top 0.61: JP11.3 SJ8.2
N$39
  Top 0.406: R21.1 X1.2@1
  Bottom 0.406: R17.2 33.96,6.9 31.86,7.45 X1.2@1
N$40
  Top 0.406: CN2.5 47.21,9.6 60.31,9.65 64.71,5.4 U$4.L-IN
N$41
  Top 0.406: U$4.R-IN 57.51,15 45.51,15 CN2.6
N$42
  Top 0.406: U$4.L-OUT C6.1
N$43
  Top 0.406: U$4.R-OUT C7.1
N$44
  Top 0.406: C6.2 R15.2
N$45
  Top 0.406: C7.2 R16.2
N$46  (via drill 0.5)
  Top 0.406: R15.1 v61.21,0.85 | v58.06,0.75 R19.2
  Bottom 0.406: v61.21,0.85 60.56,0.75 59.31,0.75 | U$5.2 57.56,1.65 v58.06,0.75 59.31,0.75 | C10.1 59.31,0.75
N$47  (via drill 0.5)
  Top 0.406: R16.1 v61.31,7.2 61.26,7.2 | v55.61,8.5 R18.2
  Bottom 0.406: v61.31,7.2 60.11,9.65 57.71,9.7 56.91,9 | 56.91,9 56.91,8 U$5.6 | v55.61,8.5 C9.1 56.91,9
N$48
  Bottom 0.406: C11.- R17.1
N$49
  Bottom 0.406: U$5.3 56.91,1.65 56.76,1.5 56.46,1.25 55.71,1.25 C8.2
N$50  (via drill 0.5)
  Top 0.406: R18.1 C9.2 | C9.2 v59.21,8.5 | v55.06,5.4 58.26,7.35 C9.2
  Bottom 0.406: U$5.7 57.56,7.8 | 57.56,7.8 C9.2 v59.21,8.5 | 57.56,7.8 58.11,8.5 | C12.+ v55.06,5.4
N$51  (via drill 0.5)
  Top 0.406: v60.66,2.7 59.74,2.68 | 59.74,2.68 59.56,1.55 R19.1 | v51.66,3.6 54.81,2.7 59.74,2.68
  Bottom 0.406: U$5.1 58.21,3.3 C10.2 59.81,3.4 v60.66,2.7 | C11.+ v51.66,3.6
N$53
  Top 0.406: R20.2 35.86,3 X1.3 R22.1
N$54  (via drill 0.5)
  Top 0.406: v45.76,6.85 R20.1
  Bottom 0.406: C12.- v45.76,6.85

### Text on the board
tNames: SOFT / SW | 1 | 4 | L1 | L4 | + | 2 | 3 | + | L2 | L3 | + | + | CN1 | 1k | L4 | L3 | RST | SCK | MISO | 1k | 1k | 1k | L2 | 1M | L1 | 1M | 1M | GND | MOSI | VCC | 5V | 1M | 1k | 2SK4017 | GND | 4.7k | Solenoid | 0.1uF | ATmega8A | 0.1uF | 1N4007 | INT | 1k | 4.7k | 1M | + | 0.1uF | EXT | 4.7k | CHEEN-RIMEN I2C Shield v0.2 | CC BY 4.0 2016 D.F.Mac. | CHEEN-SW | CN2 | POWER | 47k | 100k | 100k | TPA6111A2 | 47k | 1uF | 51 | 1uF | 47k | 47k
bNames: CHEEN-RIMEN I2C Shield v0.1 | 22uF | 0.1uF | 100p | 47uF | 51 | 47uF | 100p | 0.1uF